# Altium schematic sheet ConverterSch.SchDoc
size A3; Author: Author; Organization: Altium Limited; Address1: L3, 12a Rodborough Rd; Address2: Frenchs Forest; Address3: NSW; Address4: Australia 2086
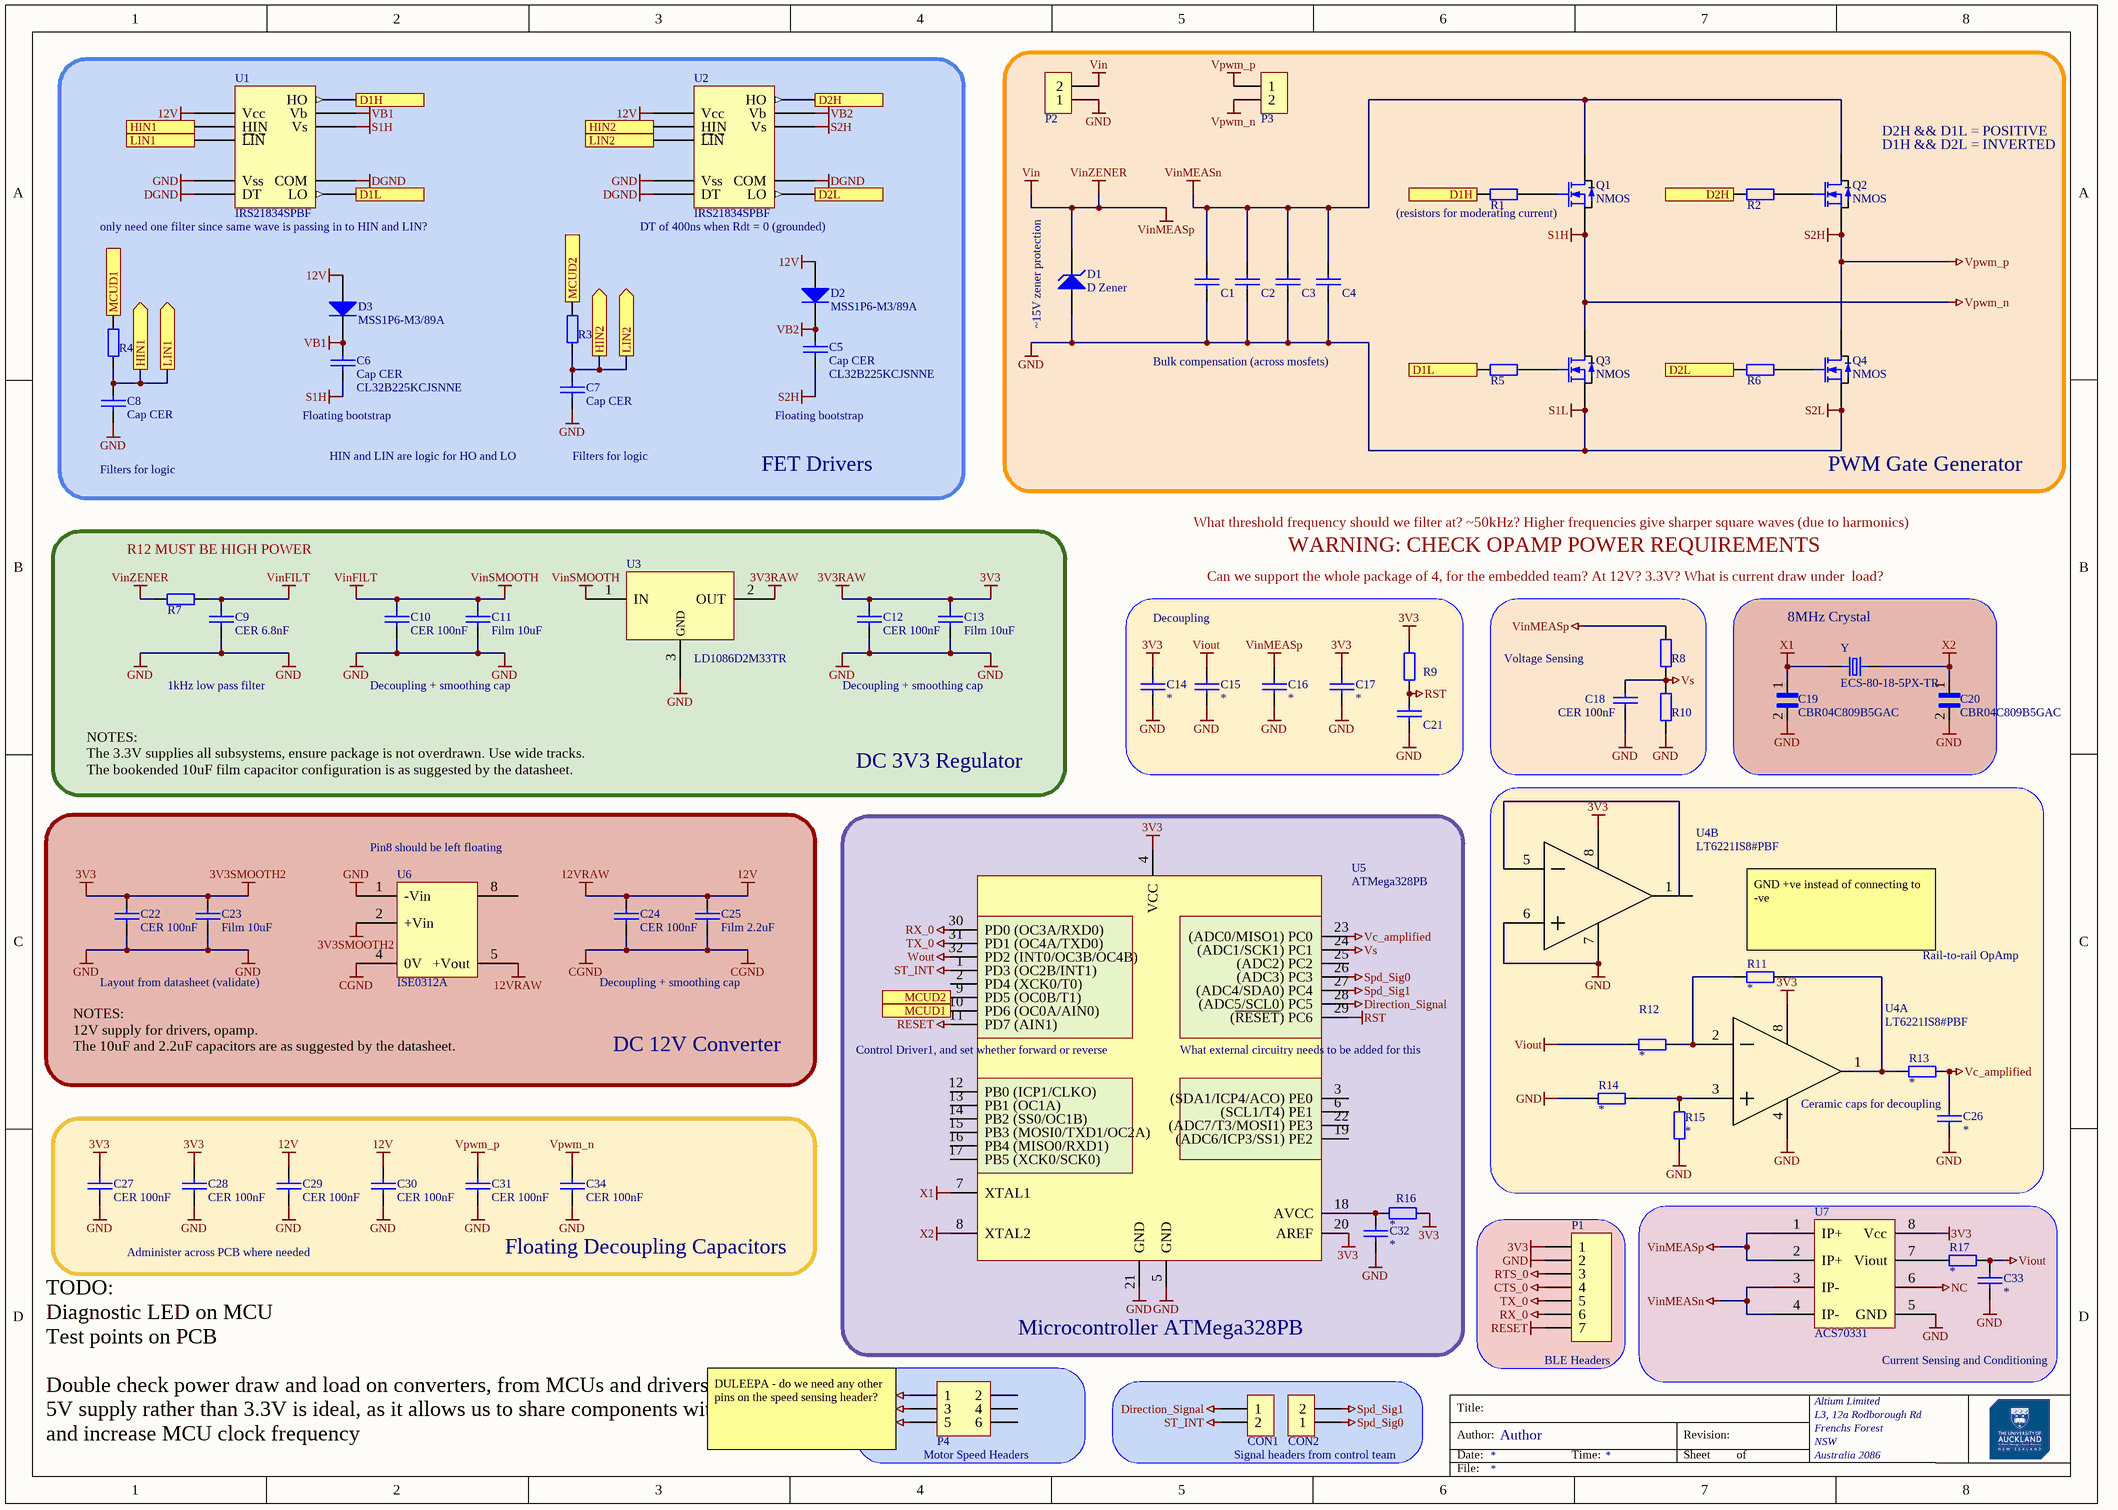
[diagram p0: ConverterSch.SchDoc]

## Parts
C1  Cap CER  [C1206]  (value not drawn)
C2  Cap CER  [C1206]  (value not drawn)
C3  Cap CER  [C1206]  (value not drawn)
C4  Cap CER  [C1206]  (value not drawn)
C5  Cap CER  Supplier Part Number 2: CL32B225KCJSNNE  [C1210]
C6  Cap CER  Supplier Part Number 2: CL32B225KCJSNNE  [C1210]
C7  Cap CER  [C1210]
C8  Cap CER  [C1210]
C9  CER 6.8nF  [C1206]
C10  CER 100nF  [C1206]
C11  Film 10uF  [LDECE4150KA0N00]
C12  CER 100nF  [C1206]
C13  Film 10uF  [LDECE4150KA0N00]
C14  *  [0805 CAP]
C15  *  [0805 CAP]
C16  *  [0805 CAP]
C17  *  [0805 CAP]
C18  CER 100nF  [C1206]
C19  CBR04C809B5GAC  [CAPC1005X55N]
C20  CBR04C809B5GAC  [CAPC1005X55N]
C21  Capacitor 0805  [C0805]  (value not drawn)
C22  CER 100nF  [C1206]
C23  Film 10uF  [LDECE4150KA0N00]
C24  CER 100nF  [C1206]
C25  Film 2.2uF  [LDECE4150KA0N00]
C26  *  [0805 CAP]
C27  CER 100nF  [C1206]
C28  CER 100nF  [C1206]
C29  CER 100nF  [C1206]
C30  CER 100nF  [C1206]
C31  CER 100nF  [C1206]
C32  *  [0805 CAP]
C33  *  [0805 CAP]
C34  CER 100nF  [C1206]
CON1  Header 2X1  [HDR2X1_5]  (value not drawn)
CON2  Header 2X1  [HDR2X1_5]  (value not drawn)
D1  D Zener  [DIODE-0.7]
D2  MSS1P6-M3/89A  [MicroSMP (DO-219AD)]
D3  MSS1P6-M3/89A  [MicroSMP (DO-219AD)]
P1  BLE Headers  [HDR1X7]
P2  Dual Banana Plugs  [Dual Banana Plug]  (value not drawn)
P3  Dual Banana Plugs  [Dual Banana Plug]  (value not drawn)
P4  HDR3X2  [HDR2X3_2P54]  (value not drawn)
Q1  NMOS  [BSC072N08NS5ATMA1_modified_v2]
Q2  NMOS  [BSC072N08NS5ATMA1_modified_v2]
Q3  NMOS  [BSC072N08NS5ATMA1_modified_v2]
Q4  NMOS  [BSC072N08NS5ATMA1_modified_v2]
R1  Resistor 0805  [R0805]  (value not drawn)
R2  Resistor 0805  [R0805]  (value not drawn)
R3  Resistor 0805  [R0805]  (value not drawn)
R4  Resistor 0805  [R0805]  (value not drawn)
R5  Resistor 0805  [R0805]  (value not drawn)
R6  Resistor 0805  [R0805]  (value not drawn)
R7  22k  [R0805]  (value not drawn)
R8  Resistor 0805  [R0805]  (value not drawn)
R9  Resistor 0805  [R0805]  (value not drawn)
R10  Resistor 0805  [R0805]  (value not drawn)
R11  *  [0805 RES]
R12  *  [0805 RES]
R13  *  [0805 RES]
R14  *  [0805 RES]
R15  *  [0805 RES]
R16  *  [0805 RES]
R17  *  [0805 RES]
U1  IRS21834SPBF  [SOIC127P600X175-14N]
U2  IRS21834SPBF  [SOIC127P600X175-14N]
U3  LD1086D2M33TR  [D2PAK-3L]
U4  LT6221IS8#PBF  [SOIC8_NARROW]  (parts A,B of 2)
U5  ATMega328PB  [TQFP32]
U6  ISE0312A  [ISE0312A]
U7  ACS70331  [ACS70331]
Y  ECS-80-18-5PX-TR  [XTAL_ECS-80-18-5PX-TR]

## Blocks framed on the sheet
FET Drivers: C5-C8 D2 D3 R3 R4 U1 U2
PWM Gate Generator: C1-C4 D1 P2 P3 Q1-Q4 R1 R2 R5 R6
DC 3V3 Regulator: C9-C13 R7 U3
Decoupling: C14-C17 C21 R9
Voltage Sensing: C18 R8 R10
8MHz Crystal: C19 C20 Y
DC 12V Converter: C22-C25 U6
Microcontroller ATMega328PB: C32 R16 U5
Floating Decoupling Capacitors: C27-C31 C34
Current Sensing and Conditioning: C33 R17 U7
Motor Speed Headers: P4
Signal headers from control team: CON1 CON2

## Ports
D1H (in), D1H (out), D1L (in), D1L (out), D2H (in), D2H (out), D2L (in), D2L (out), HIN1 (in), HIN1 (out), HIN2 (in), HIN2 (out), LIN1 (in), LIN1 (out), LIN2 (in), LIN2 (out), MCUD1 (in), MCUD2 (in)

## Nets
3V3: C12.2 C13.2 C14.1 C17.1 C22.2 C23.2 C27.2 C28.2 P1.1 R9.2 R16.2 U3.2(OUT) U4.8 U5.4(VCC) U5.20(AREF) U6.2(+Vin) U7.8(Vcc)  [also labelled 3V3RAW, 3V3SMOOTH2]
12V: C24.2 C25.2 C29.2 C30.2 D2.1(A) D3.1(A) U1.7(Vcc) U2.7(Vcc) U6.5(+Vout)  [also labelled 12VRAW]
CGND: C24.1 C25.1 U6.4(0V)
CTS_0: P1.4
DGND: U1.4(DT) U1.5(COM) U2.4(DT) U2.5(COM)
Direction_Signal: CON1.1 U5.28((ADC5/SCL0)_PC5)
GND: C1.1 C2.1 C3.1 C4.1 C7.1 C8.1 C9.1 C10.1 C11.1 C12.1 C13.1 C14.2 C15.2 C16.2 C17.2 C18.1 C19.2 C20.2 C21.2 C22.1 C23.1 C26.2 C27.1 C28.1 C29.1 C30.1 C31.1 C32.2 C33.2 C34.1 D1.1(A) P1.2 P2.1 P4.5 Q3.1(S) Q4.1(S) R10.1 R14.1 R15.1 U1.3(Vss) U2.3(Vss) U3.3(GND) U4.4 U4.6 U4.7 U5.5(GND) U5.21(GND) U6.1(-Vin) U7.5(GND)  [also labelled S1L, S2L]
NC: U7.6
RESET: P1.7 U5.11(PD7_(AIN1))
RST: C21.1 R9.1 U5.29((~{RESET})_PC6)
RTS_0: P1.3
RX_0: P1.6 U5.30(PD0_(OC3A/RXD0))
S1H: C6.1 C34.2 P3.2 Q1.1(S) Q3.8(D) U1.11(Vs)  [also labelled Vpwm_n]
S2H: C5.1 C31.2 P3.1 Q2.1(S) Q4.8(D) U2.11(Vs)  [also labelled Vpwm_p]
Spd_Sig0: CON2.1 U5.26((ADC3)_PC3)
Spd_Sig1: CON2.2 U5.27((ADC4/SDA0)_PC4)
ST_INT: CON1.2 U5.1(PD3_(OC2B/INT1))
TX_0: P1.5 U5.31(PD1_(OC4A/TXD0))
VB1: C6.2 D3.2(K) U1.13(Vb)
VB2: C5.2 D2.2(K) U2.13(Vb)
Vc_amplified: C26.1 R13.2 U5.23((ADC0/MISO1)_PC0)
Vcc: P4.3
Vin: C16.1 D1.2(K) P2.2 R7.1 R8.2 U7.1(IP+) U7.2(IP+)  [also labelled VinMEASp, VinZENER]
VinFILT: C9.2 C10.2 C11.2 R7.2 U3.1(IN)  [also labelled VinSMOOTH]
VinMEASn: C1.2 C2.2 C3.2 C4.2 Q1.8(D) Q2.8(D) U7.3(IP-) U7.4(IP-)
Viout: C15.1 C33.1 R12.1 R17.2
Vs: C18.2 R8.1 R10.2 U5.24((ADC1/SCK1)_PC1)
Wout: P4.1 U5.32(PD2_(INT0/OC3B/OC4B))
X1: C19.1 U5.7(XTAL1) Y.1
X2: C20.1 U5.8(XTAL2) Y.2
D1H: R1.1 U1.12(HO) ; port D1H
D1L: R5.1 U1.6(LO) ; port D1L
D2H: R2.1 U2.12(HO) ; port D2H
D2L: R6.1 U2.6(LO) ; port D2L
HIN1: C8.2 R4.1 U1.1(HIN) U1.2(L̅I̅N̅) ; port HIN1, port LIN1
HIN2: C7.2 R3.1 U2.1(HIN) U2.2(L̅I̅N̅) ; port HIN2, port LIN2
MCUD1: R4.2 U5.10(PD6_(OC0A/AIN0)) ; port MCUD1
MCUD2: R3.2 U5.9(PD5_(OC0B/T1)) ; port MCUD2
NetC32_1: C32.1 R16.1 U5.18(AVCC)
NetQ1_4: Q1.4(G) R1.2
NetQ2_4: Q2.4(G) R2.2
NetQ3_4: Q3.4(G) R5.2
NetQ4_4: Q4.4(G) R6.2
NetR11_1: R11.1 R12.2 U4.2
NetR11_2: R11.2 R13.1 U4.1
NetR14_2: R14.2 R15.2 U4.3
NetR17_1: R17.1 U7.7(Viout)

Not connected (* = marked no-connect by the designer): P4 2 4 6; U4 5; U5 2(PD4_(XCK0/T0)) 3((SDA1/ICP4/ACO)_PE0) 6((SCL1/T4)_PE1) 12(PB0_(ICP1/CLKO)) 13(PB1_(OC1A)) 14(PB2_(SS0/OC1B)) 15(PB3_(MOSI0/TXD1/OC2A)) 16(PB4_(MISO0/RXD1)) 17(PB5_(XCK0/SCK0)) 19((ADC6/ICP3/SS1)_PE2) 22((ADC7/T3/MOSI1)_PE3) 25((ADC2)_PC2); U6 8

## Notes on the sheet
- D2H && D1L = POSITIVE
- (near Q2) D1H && D2L = INVERTED
- (near U1) only need one filter since same wave is passing in to HIN and LIN?
- (near U2) DT of 400ns when Rdt = 0 (grounded)
- (near Q1) (resistors for moderating current)
- (near D1) ~15V zener protection
- Bulk compensation (across mosfets)
- (near C6) Floating bootstrap
- Floating bootstrap
- Filters for logic
- HIN and LIN are logic for HO and LO
- R12 MUST BE HIGH POWER
- What threshold frequency should we filter at? ~50kHz? Higher frequencies give sharper square waves (due to harmonics)
- Can we support the whole package of 4, for the embedded team? At 12V? 3.3V? What is current draw under  load?
- WARNING: CHECK OPAMP POWER REQUIREMENTS
- 1kHz low pass filter
- Decoupling + smoothing cap
- NOTES:
  The 3.3V supplies all subsystems, ensure package is not overdrawn. Use wide tracks.
  The bookended 10uF film capacitor configuration is as suggested by the datasheet.
- (near U6) Pin8 should be left floating
- Layout from datasheet (validate)
- (near R11) GND +ve instead of connecting to -ve
- Rail-to-rail OpAmp
- (near U5) Control Driver1, and set whether forward or reverse
- (near U5) What external circuitry needs to be added for this
- (near U6) NOTES:
  12V supply for drivers, opamp.
  The 10uF and 2.2uF capacitors are as suggested by the datasheet.
- Ceramic caps for decoupling
- Administer across PCB where needed
- (near P4) DULEEPA - do we need any other pins on the speed sensing header?
- TODO:
  Diagnostic LED on MCU
  Test points on PCB
  Double check power draw and load on converters, from MCUs and drivers
  5V supply rather than 3.3V is ideal, as it allows us to share components with primary and increase MCU clock frequency
- Title:
- Author:
- Date:
- Time:
- Revision:
- Sheet
- of
- File:

## Library data of the parts
C1-C4 C9 C10 C12 C18 C22 C24 C27-C31 C34 = Cap CER Decoup C3216C0G2A104J160AC: CAP CER 0.1UF 100V C0G 1206; Manufacturer: TDK Corporation; Type: Surface mount; Value: 100nF/100V; MPN: C3216C0G2A104J160AC; Part Description: CAP CER 0.1UF 100V C0G 1206; Supplier 1: RSComponents; Supplier Part Number 1: 1795799; Supplier 2: Element14; Supplier Part Number 4: 810-C3216C0G2A104J6C; Supplier Part Number 3: 445-172677-1-ND; Supplier Part Number 2: 2906828; Supplier 4: Mouser; Supplier 3: Digi-Key
C5-C8 = Cap CER HF DC-Link CL32B225KCJSNNE: CAP CER 2.2UF 100V X7R 1210; Manufacturer: AVX Corporation; Type: Surface mount; Value: 2200nF/100V; MPN: CL32B225KCJSNNE; Part Description: CAP CER 2.2UF 100V X7R 1210; Supplier 1: Digi-Key; Supplier Part Number 1: 1276-3362-1-ND; Supplier 2: Arrow
C11 C13 C23 C25 = Cap Film SMD LDECE4150KA0N00: CAP FILM 1.5UF 10% 50VDC 2824; Manufacturer: KEMET; Type: Surface mount; Value: 1.5uF/50V; MPN: LDECE4150KA0N00; Supplier 1: Element14; Supplier 2: RSComponents; Part Description: CAP FILM 1.5UF 10% 50VDC 2824; Supplier Part Number 4: 80-LDECE4150KA0N00; Supplier Part Number 3: 399-12858-1-ND; Supplier Part Number 2: 1650342; Supplier Part Number 1: 2495712; Supplier 4: Mouser; Supplier 3: Digi-Key
C14-C17 C26 C32 C33 = CerCap_SMT_0805: SMT ceramic capacitor 0805 size; Value: *
C19 C20 = CBR04C809B5GAC: CAP CER 8PF 50V NP0 0402; Package: None; Price: None; Value: *; MP: CBR04C809B5GAC; Availability: Unavailable
C21 = CCAP0805
CON1 CON2 = HDR2X1
D1 = D Zener: Zener Diode; Published: 8-Jun-2000; LatestRevisionDate: 17-Jul-2002; LatestRevisionNote: Re-released for DXP Platform.; PackageReference: DIODE-0.7; Publisher: Altium Limited; PackageDescription: Diode, Thru-Hole; 2 Leads; 0.7 in Pin Spacing
D2 D3 = Diode MSS1P6-M3/89A: DIODE SCHOTTKY 60V 1A MICROSMP; Manufacturer: Vishay Semiconductor Diodes Division; Type: Surface mount; MPN: MSS1P6-M3/89A; Supplier 1: RSComponents; Supplier 2: Element14; Part Description: DIODE SCHOTTKY 60V 1A MICROSMP; Supplier Part Number 2: 2335157; Supplier Part Number 1: 7103070P
P1 = Header 7: Header, 7-Pin; LatestRevisionDate: 17-Jul-2002; LatestRevisionNote: Re-released for DXP Platform.; Publisher: Altium Limited
P2 P3 = AC_Output: Dual banana plugs connection to the AC load; LatestRevisionDate: 17-Jul-2002; LatestRevisionNote: Re-released for DXP Platform.; Publisher: Altium Limited
P4 = HDR3X2: Header, 3-Pin, Dual row
Q1-Q4 = NMOS OptiMOS BSC072N08NS5ATMA1: MOSFET N-CH 80V 74A 8TDSON; Manufacturer: Infineon Technologies; Type: Surface mount; MPN: BSC072N08NS5ATMA1; Supplier 1: Element14; Part Description: MOSFET N-CH 80V 74A 8TDSON; Supplier Part Number 3: 726-BSC072N08NS5ATMA; Supplier Part Number 1: 2725812; Supplier 3: Mouser; Supplier Part Number 2: BSC072N08NS5ATMA1CT-ND; Supplier 2: Digi-Key
R1-R10 = RES0805
  R1-R8 R10: MPN: ?; Value: ?; Part Description: ?; Type: Surface Mount
R11-R17 = Res_SMT_0805: 0805 resistor; Published: 8-Jun-2000; LatestRevisionDate: 17-Jul-2002; LatestRevisionNote: Re-released for DXP Platform.; PackageReference: AXIAL-0.4; Publisher: Altium Limited; Value: *; ComponentLink1Description: https://nz.mouser.com/datasheet/2/315/AOA0000C304-1149620.pdf
U1 U2 = IRS21834SPBF: IC GATE DRVR HALF-BRIDGE 14SOIC
U3 = LD1086D2M33TR: 3.3V linear voltage regulator
U5 = ATMega328PB: IC MCU 8BIT 32KB FLASH 32TQFP; Supplier 1: Digi-Key; Supplier Part Number 1: ATMEGA328PB-AU-ND; Supplier 2: Digikey; Supplier Part Number 2: ATMEGA328PB-AU-ND
U6 = ISE0312A_8-SMD_5L: 3V-12V DC DC converter
U7 = ACS70331_SOIC_8L: 1MHz high sensitivity current sensor
Y = ECS-80-18-5PX-TR: 8MHz Â±30ppm Crystal 18pF 60 Ohms HC-49/US; MF: ECS Inc.; SnapEDA_Link: https://www.snapeda.com/parts/ECS-80-18-5PX-TR/ECS%20Inc./view-part/470513/?ref=snap; Digi-Key_Purchase_URL: https://www.digikey.com/product-detail/en/ecs-inc/ECS-80-18-5PX-TR/XC1271CT-ND/827735?utm_source=snapeda&utm_medium=aggregator&utm_campaign=symbol; MP: ECS-80-18-5PX-TR; Digi-Key_Part_Number: XC1271CT-ND; Value: *; Package: HC49/US ECS International